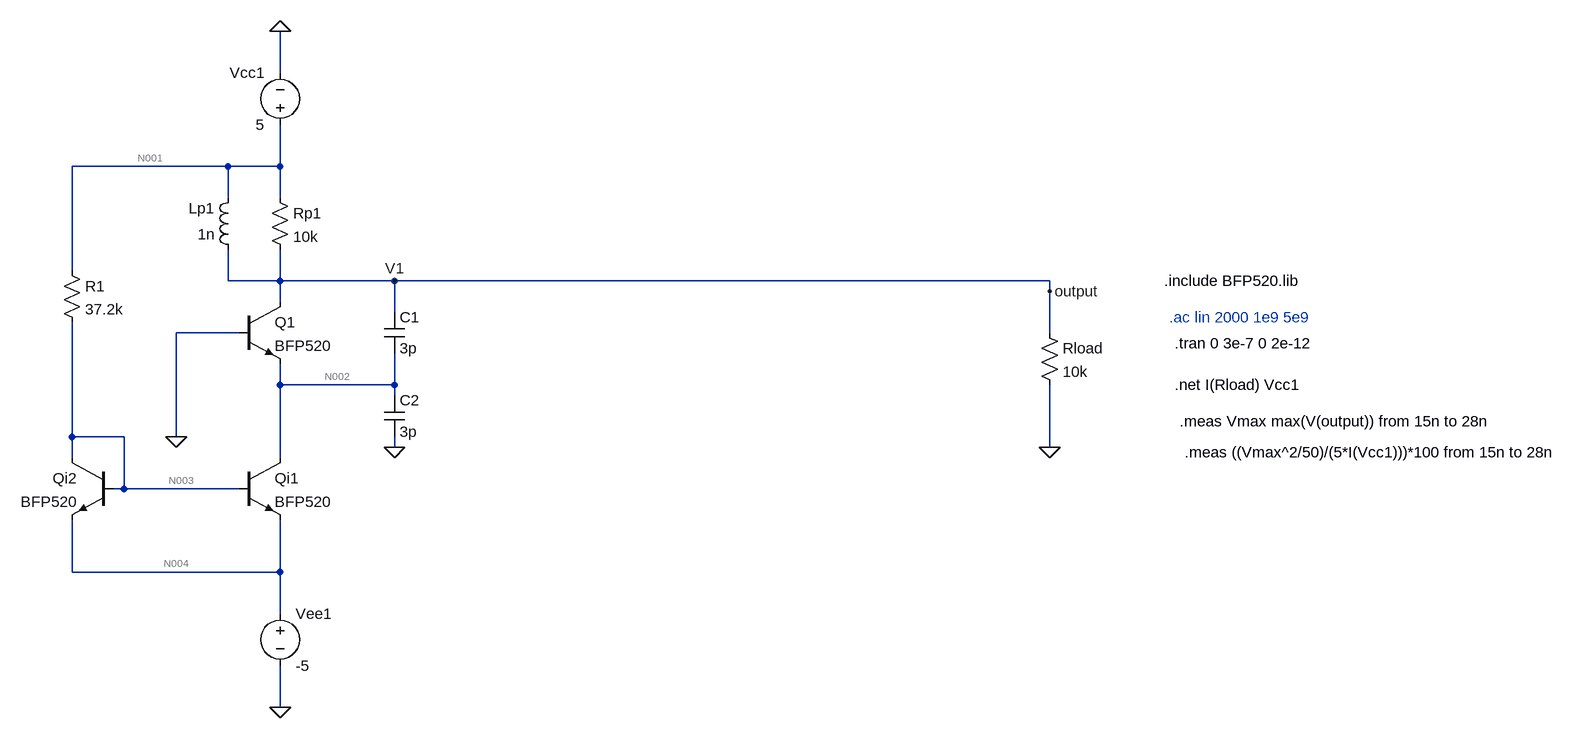
[diagram p0: schematic full-system.asc]
full-system.asc, the LTspice schematic file:
Version 4
SHEET 1 2092 832
WIRE 80 -160 80 -224
WIRE 0 -16 -240 -16
WIRE 80 -16 80 -80
WIRE 80 -16 0 -16
WIRE 0 32 0 -16
WIRE 80 32 80 -16
WIRE -240 144 -240 -16
WIRE 0 160 0 112
WIRE 80 160 80 112
WIRE 80 160 0 160
WIRE 256 160 80 160
WIRE 1264 160 256 160
WIRE 1264 176 1264 160
WIRE 80 192 80 160
WIRE 256 208 256 160
WIRE 16 240 -80 240
WIRE 1264 240 1264 176
WIRE 80 320 80 288
WIRE 256 320 256 272
WIRE 256 320 80 320
WIRE 256 336 256 320
WIRE -240 400 -240 224
WIRE -160 400 -240 400
WIRE -80 400 -80 240
WIRE 256 416 256 400
WIRE 1264 416 1264 320
WIRE -240 432 -240 400
WIRE 80 432 80 320
WIRE -160 480 -160 400
WIRE -160 480 -176 480
WIRE 16 480 -160 480
WIRE -240 608 -240 528
WIRE 80 608 80 528
WIRE 80 608 -240 608
WIRE 80 672 80 608
WIRE 80 816 80 752
FLAG 80 -224 0
FLAG 80 816 0
FLAG -80 400 0
FLAG 256 416 0
FLAG 256 160 V1
FLAG 1264 416 0
FLAG 1264 176 output
SYMBOL npn 16 192 R0
SYMATTR InstName Q1
SYMATTR Value BFP520
SYMBOL ind 16 128 R180
WINDOW 0 36 80 Left 2
WINDOW 3 36 40 Left 2
SYMATTR InstName Lp1
SYMATTR Value 1n
SYMBOL Res 64 16 R0
SYMATTR InstName Rp1
SYMATTR Value 10k
SYMBOL Voltage 80 -64 R180
WINDOW 0 24 96 Left 2
WINDOW 3 24 16 Left 2
SYMATTR InstName Vcc1
SYMATTR Value 5
SYMBOL npn 16 432 R0
SYMATTR InstName Qi1
SYMATTR Value BFP520
SYMBOL npn -176 432 M0
SYMATTR InstName Qi2
SYMATTR Value BFP520
SYMBOL Res -256 128 R0
SYMATTR InstName R1
SYMATTR Value 37.2k
SYMBOL Voltage 80 656 R0
SYMATTR InstName Vee1
SYMATTR Value -5
SYMBOL cap 240 208 R0
SYMATTR InstName C1
SYMATTR Value 3p
SYMBOL cap 240 336 R0
SYMATTR InstName C2
SYMATTR Value 3p
SYMBOL Res 1248 224 R0
SYMATTR InstName Rload
SYMATTR Value 10k
TEXT 1440 160 Left 2 !.include BFP520.lib
TEXT 1448 216 Left 2 ;.ac lin 2000 1e9 5e9
TEXT 1456 256 Left 2 !.tran 0 3e-7 0 2e-12
TEXT 1456 320 Left 2 !.net I(Rload) Vcc1
TEXT 1464 376 Left 2 !.meas Vmax max(V(output)) from 15n to 28n
TEXT 1472 424 Left 2 !.meas ((Vmax^2/50)/(5*I(Vcc1)))*100 from 15n to 28n

The netlist it stands for:
* full-system.asc
Q1 output 0 N002 0 BFP520
Lp1 output N001 1n
Rp1 N001 output 10k
Vcc1 N001 0 5
Qi1 N002 N003 N004 0 BFP520
Qi2 N003 N003 N004 0 BFP520
R1 N001 N003 37.2k
Vee1 N004 0 -5
C1 output N002 3p
C2 N002 0 3p
Rload output 0 10k
.model NPN NPN
.model PNP PNP
.lib standard.bjt
.include BFP520.lib
* .ac lin 2000 1e9 5e9
.tran 0 3e-7 0 2e-12
.net I(Rload) Vcc1
.meas Vmax max(V(output)) from 15n to 28n
.meas ((Vmax^2/50)/(5*I(Vcc1)))*100 from 15n to 28n
.backanno
.end

* Results of the author's LTspice run, read from the files saved beside the schematic
* Operating Point, zero values left out:
*   V(output) = 5 V
*   V(n002) = -797.8 mV
*   V(n001) = 5 V
*   V(n003) = -4.2 V
*   V(n004) = -5 V
*   Ic(Q1) = 296.8 µA
*   Ib(Q1) = 1.702 µA
*   Ie(Q1) = -298.5 µA
*   Ic(Qi1) = 298.5 µA
*   Ib(Qi1) = 1.857 µA
*   Ie(Qi1) = -300.3 µA
*   Ic(Qi2) = 243.6 µA
*   Ib(Qi2) = 1.86 µA
*   Ie(Qi2) = -245.4 µA
*   I(Lp1) = -796.8 µA
*   I(Rp1) = 79.68 pA
*   I(R1) = 247.3 µA
*   I(Rload) = 500 µA
*   I(Vcc1) = -1.044 mA
*   I(Vee1) = 545.8 µA
* From the log:
*   vmax: MAX(v(output))=5.00001 FROM 1.5e-08 TO 2.8e-08
*   ((vmax^2/50)/(5*i(vcc1)))*100=1.3e-08 FROM 1.5e-08 TO 2.8e-08